# Altium schematic sheet Sch_Dr_AnIn.SchDoc
size A4; Author: Noname; CompanyName: Spec Company; Address3: ULY; Revision: ver.1.0
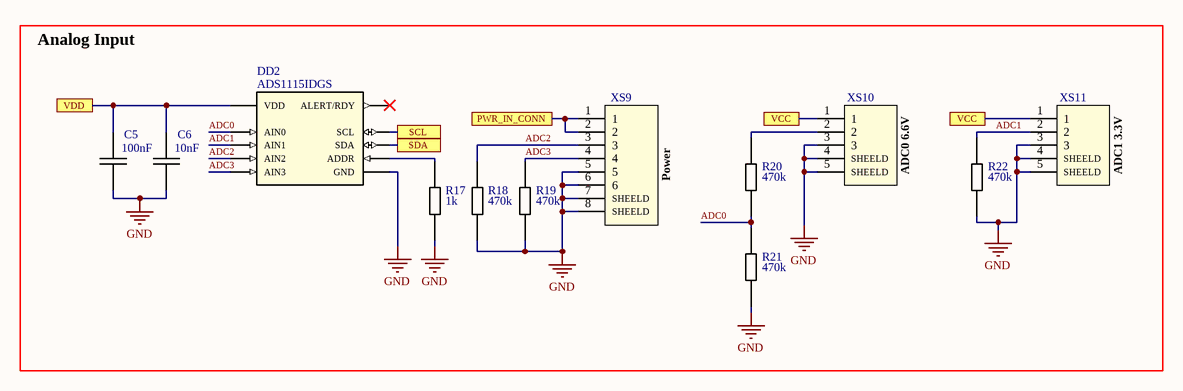
[diagram p0: Sch_Dr_AnIn.SchDoc]

## Parts
C5  100nF  [Cap_0603]
C6  10nF  [Cap_0603]
DD2  ADS1115IDGS  [MSOP-10]
R17  1k  [Res_0603]
R18  470k  [Res_0603]
R19  470k  [Res_0603]
R20  470k  [Res_0603]
R21  470k  [Res_0603]
R22  470k  [Res_0603]
XS9  BM06B-GHS-TBT(LF)(SN)(N)  [BM06B-GHS-TBT]  (value not drawn)
XS10  BM03B-GHS-TBT  [BM03B-GHS-TBT]  (value not drawn)
XS11  BM03B-GHS-TBT  [BM03B-GHS-TBT]  (value not drawn)

## Ports
PWR_IN_CONN, SCL, SDA, VCC, VDD

## Nets
GND: C5.1 C6.1 DD2.3(GND) R17.2 R18.2 R19.2 R21.2 R22.2 XS9.5 XS9.6 XS9.7(SHEELD) XS9.8(SHEELD) XS10.3 XS10.4(SHEELD) XS10.5(SHEELD) XS11.3 XS11.4(SHEELD) XS11.5(SHEELD)
ADC0: DD2.4(AIN0) R20.2 R21.1
ADC1: DD2.5(AIN1) R22.1 XS11.2
ADC2: DD2.6(AIN2) R18.1 XS9.3
ADC3: DD2.7(AIN3) R19.1 XS9.4
PWR_IN_CONN: XS9.1 XS9.2 ; port PWR_IN_CONN
SCL: DD2.10(SCL) ; port SCL
SDA: DD2.9(SDA) ; port SDA
VCC: XS10.1 XS11.1 ; port VCC
VDD: C5.2 C6.2 DD2.8(VDD) ; port VDD
NetDD2_1: DD2.1(ADDR) R17.1
NetR20_1: R20.1 XS10.2

Not connected (* = marked no-connect by the designer): DD2 2(ALERT/RDY)*

## Notes on the sheet
- Analog Input
- ADC0 6.6V
- ADC1 3.3V
- Power
- Title
- Size:
- Date:
- A4
- Number:
- Time:
- Revision:
- Sheet
- of
- File:

## Library data of the parts
C5 = Cap_: CC0603JRX7R8BB104
C6 = Cap_: CC0603JRNPO9BN103
DD2 = ADS1115IDGS: Ultra-Small, Low-Power, 16-Bit, ADC with Internal Reference, 4-channel
R17 = Res_: CR-03FL7----1K
R18-R22 = Res_: CR-03FL7--470K